# Altium project PMI_Split.PrjPCB
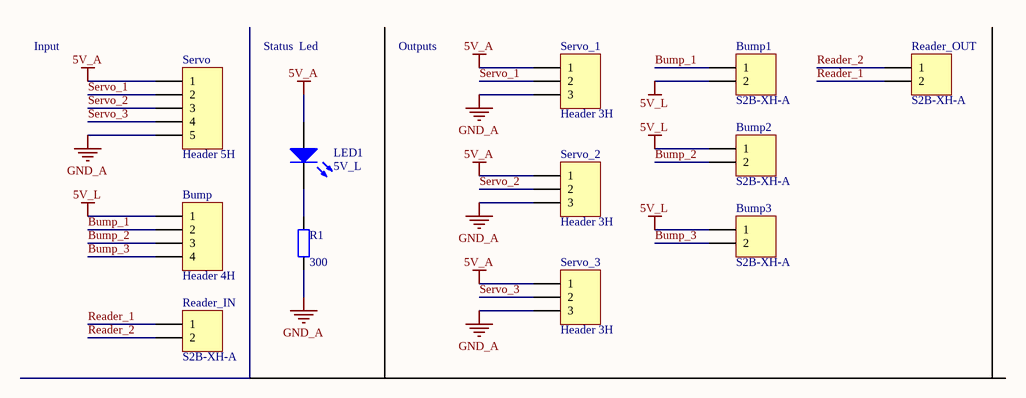
[diagram p0: PMI_Split.SchDoc]
1 sheet, 12 parts. Net scope: global (net labels, ports and power ports of the same name join across sheets).
Board file: PMI_Split.PcbDoc

## Sheet PMI_Split.SchDoc
size A4

### Parts
Bump  Header 4H  [S4B-XH-A]
Bump1  S2B-XH-A  [S2B-XH-A]
Bump2  S2B-XH-A  [S2B-XH-A]
Bump3  S2B-XH-A  [S2B-XH-A]
LED1  5V_L  [KP-3216SEC]
R1  value 300  [Resistor 1206]  (hidden comment: Res2)
Reader_IN  S2B-XH-A  [S2B-XH-A]
Reader_OUT  S2B-XH-A  [S2B-XH-A]
Servo  Header 5H  [S5B-XH-A]
Servo_1  Header 3H  [S3B-XH-A]
Servo_2  Header 3H  [S3B-XH-A]
Servo_3  Header 3H  [S3B-XH-A]

### Nets
5V_A: LED1.1(A) Servo.1 Servo_1.1 Servo_2.1 Servo_3.1
5V_L: Bump.1 Bump1.2 Bump2.1 Bump3.1
GND_A: R1.1 Servo.5 Servo_1.3 Servo_2.3 Servo_3.3
Bump_1: Bump.2 Bump1.1
Bump_2: Bump.3 Bump2.2
Bump_3: Bump.4 Bump3.2
Reader_1: Reader_IN.1 Reader_OUT.2
Reader_2: Reader_IN.2 Reader_OUT.1
Servo_1: Servo.2 Servo_1.2
Servo_2: Servo.3 Servo_2.2
Servo_3: Servo.4 Servo_3.2
NetLED1_2: LED1.2(K) R1.2

### Notes on the sheet
- Input
- Status  Led
- Outputs

### Library data of the parts
Bump = Header 4H: Header, 4-Pin, Right Angle; LatestRevisionDate: 17-Jul-2002; LatestRevisionNote: Re-released for DXP Platform.; Publisher: Altium Limited
Bump1-Bump3 Reader_IN Reader_OUT = Header 2H: Header, 2-Pin, Right Angle; LatestRevisionDate: 17-Jul-2002; LatestRevisionNote: Re-released for DXP Platform.; Publisher: Altium Limited
LED1 = LED2: Typical RED, GREEN, YELLOW, AMBER GaAs LED; Published: 8-Jun-2000; LatestRevisionDate: 17-Jul-2002; LatestRevisionNote: Re-released for DXP Platform.; PackageVersion: Feb-2002; PackageReference: 3.2X1.6X1.1; Publisher: Altium Limited; PackageDescription: SM LED; 2 Flat Leads
R1 = Res2: Resistor; Published: 8-Jun-2000; LatestRevisionDate: 17-Jul-2002; LatestRevisionNote: Re-released for DXP Platform.; PackageReference: AXIAL-0.4; Publisher: Altium Limited; PackageDescription: Axial Device, Thru-Hole; 2 Leads; 0.4 in Pin Spacing
Servo = Header 5H: Header, 5-Pin, Right Angle; LatestRevisionDate: 17-Jul-2002; LatestRevisionNote: Re-released for DXP Platform.; Publisher: Altium Limited
Servo_1-Servo_3 = Header 3H: Header, 3-Pin, Right Angle; LatestRevisionDate: 17-Jul-2002; LatestRevisionNote: Re-released for DXP Platform.; Publisher: Altium Limited